# EAGLE design Master (EAGLE 9.6.2)
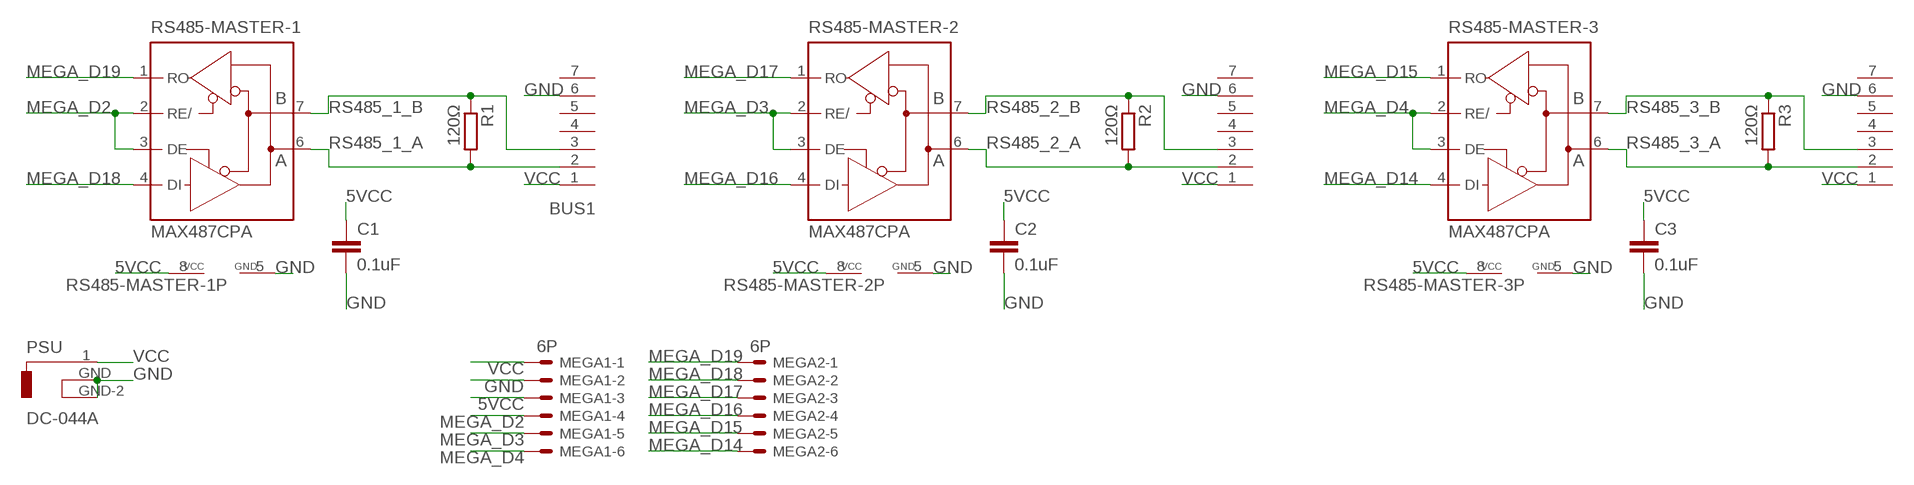
[diagram p0: schematic, sheet 1]

## Parts
BUS1  GX12-7P  [GX12-7P]
BUS2  GX12-7P  [GX12-7P]
BUS3  GX12-7P  [GX12-7P]
C1  0.1uF  C-EU025-025X050  [C025-025X050]
C2  0.1uF  C-EU025-025X050  [C025-025X050]
C3  0.1uF  C-EU025-025X050  [C025-025X050]
MEGA1  6P  22-23-2061  [22-23-2061]
MEGA2  6P  22-23-2061  [22-23-2061]
PSU  DC-044A  [DC-044A]
R1  120Ω  R-EU_0207/10  [0207/10]
R2  120Ω  R-EU_0207/10  [0207/10]
R3  120Ω  R-EU_0207/10  [0207/10]
RS485-MASTER-1  MAX487CPA  [DIL08]
RS485-MASTER-2  MAX487CPA  [DIL08]
RS485-MASTER-3  MAX487CPA  [DIL08]

## Nets
5VCC: C1.1 C2.1 C3.1 MEGA1.3 RS485-MASTER-1.8(VCC) RS485-MASTER-2.8(VCC) RS485-MASTER-3.8(VCC)
GND: BUS1.6 BUS2.6 BUS3.6 C1.2 C2.2 C3.2 MEGA1.2 PSU.GND PSU.GND-2 RS485-MASTER-1.5(GND) RS485-MASTER-2.5(GND) RS485-MASTER-3.5(GND)
MEGA_D2: MEGA1.4 RS485-MASTER-1.2(RE/) RS485-MASTER-1.3(DE)
MEGA_D3: MEGA1.5 RS485-MASTER-2.2(RE/) RS485-MASTER-2.3(DE)
MEGA_D4: MEGA1.6 RS485-MASTER-3.2(RE/) RS485-MASTER-3.3(DE)
MEGA_D14: MEGA2.6 RS485-MASTER-3.4(DI)
MEGA_D15: MEGA2.5 RS485-MASTER-3.1(RO)
MEGA_D16: MEGA2.4 RS485-MASTER-2.4(DI)
MEGA_D17: MEGA2.3 RS485-MASTER-2.1(RO)
MEGA_D18: MEGA2.2 RS485-MASTER-1.4(DI)
MEGA_D19: MEGA2.1 RS485-MASTER-1.1(RO)
RS485_1_A: BUS1.2 R1.2 RS485-MASTER-1.6(A)
RS485_1_B: BUS1.3 R1.1 RS485-MASTER-1.7(B)
RS485_2_A: BUS2.2 R2.2 RS485-MASTER-2.6(A)
RS485_2_B: BUS2.3 R2.1 RS485-MASTER-2.7(B)
RS485_3_A: BUS3.2 R3.2 RS485-MASTER-3.6(A)
RS485_3_B: BUS3.3 R3.1 RS485-MASTER-3.7(B)
VCC: BUS1.1 BUS2.1 BUS3.1 MEGA1.1 PSU.1
Unconnected: BUS1.4 BUS1.5 BUS1.7 BUS2.4 BUS2.5 BUS2.7 BUS3.4 BUS3.5 BUS3.7

## Library data of the parts
BUS1-BUS3 = A10 Library:GX12-7P: GX12 Aviation Connector, 7 pin.
C1-C3 = rcl:C-EU: CAPACITOR, European symbol; SPICEPREFIX: C
MEGA1 MEGA2 = con-molex:22-23-2061: .100" (2.54mm) Center Header - 6 Pin; MF: MOLEX; MPN: 22-23-2061; OC_FARNELL: 1462922; OC_NEWARK: 27C1933
PSU = A10 Library:DC-044A
R1-R3 = rcl:R-EU_: RESISTOR, European symbol; SPICEPREFIX: R
RS485-MASTER-1-RS485-MASTER-3 = A10 Library:MAX487CPA: RS485 TRANSEIVER; MPN: MAX487CPA; OC_FARNELL: unknown; OC_NEWARK: unknown

## Net classes
0 default: width 0.406 mm, drill 0.254 mm, clearance 0.406 mm

## Board
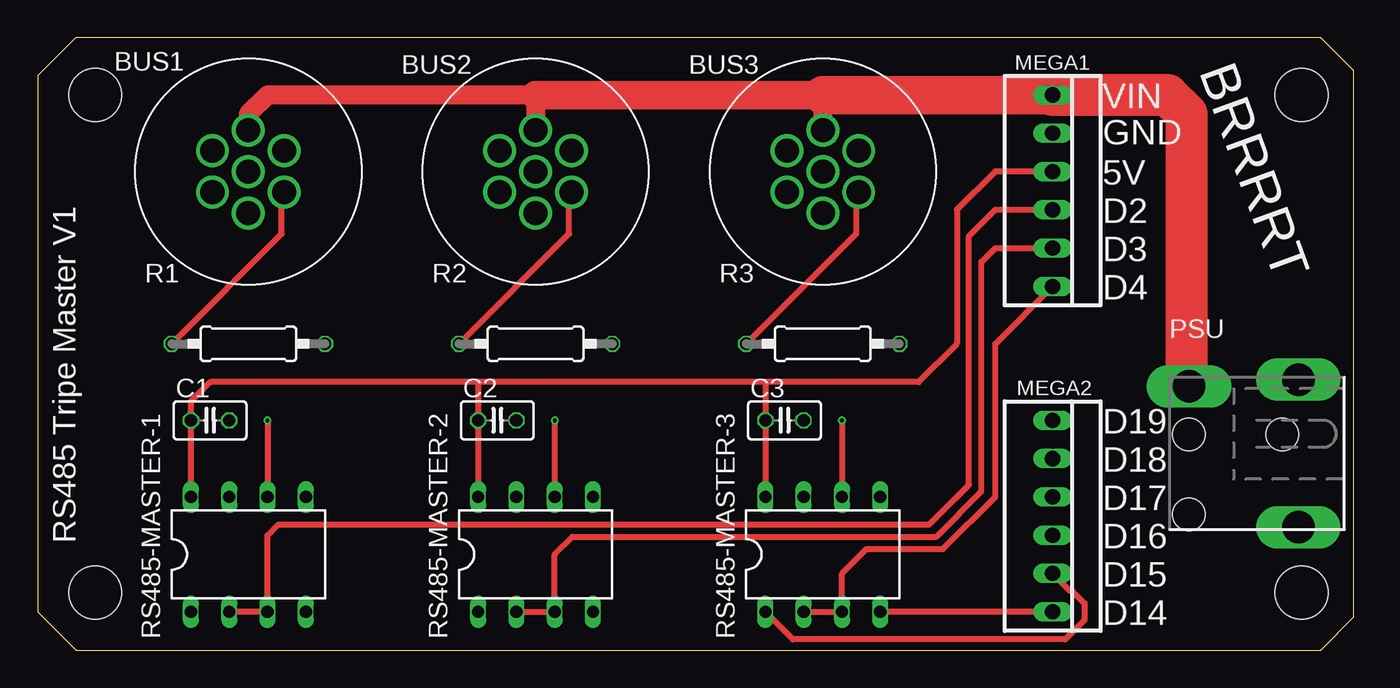
[diagram p1: board, top side]
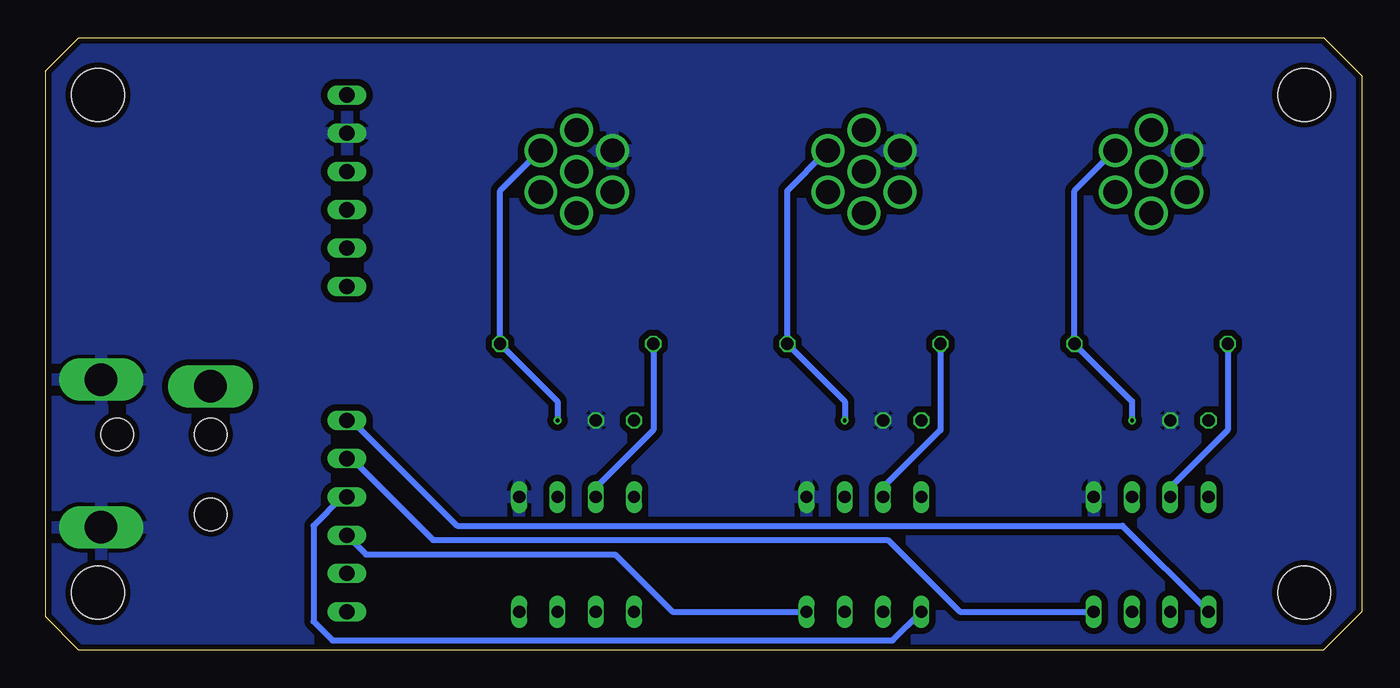
[diagram p2: board, bottom side, seen from below]

Size 87.3 x 40.63 mm. Coordinates in mm from the lower left corner, seen from the top.
Outline: 0,38.1 0,2.54 2.54,0 85.09,0 87.3,2.21 87.3,38.43 85.1,40.63 2.53,40.63 0,38.1
Copper layers (1*16): Top 0.035559375mm / dielectric 1.6mm / Bottom 0.035559375mm
Design rules "oshpark-2layer *": minimum track width 6mil, minimum drill 10mil, track to track 6mil, track to pad 6mil, pad to pad 6mil, via to via 6mil, smd to smd 6mil, copper to edge 15mil, drill to drill 6mil, minimum pad ring 5mil, minimum via ring 5mil, stop-mask expansion 2.5mil, vias tented up to drill 0mil, thermal gap 10mil
Holes 3.5 mm at 3.81,36.83 3.81,3.81 83.82,36.83 83.82,3.81

### Footprints (pad centres in the part's own frame; a part is rotated, then mirrored left to right if it is on the bottom)
GX12-7P = drill 1.6 pad 2.184: 1 0,2.75; 2 2.381,1.375; 3 2.381,-1.375; 4 0,-2.75; 5 -2.381,-1.375; 6 -2.381,1.375; 7 0,0
C025-025X050 = drill 0.813 octagon: 1 -1.27,0; 2 1.27,0
22-23-2061 = drill 1 long: 1 -6.35,0; 2 -3.81,0; 3 -1.27,0; 4 1.27,0; 5 3.81,0; 6 6.35,0
DC-044A = drill 2.159 pad 2.794 long: 1 4.42,3.78; GND 4.87,-3.47; GND-2 -4.93,-3.47 | hole 2.159: 1.22,-2.42; -4.08,3.78; 1.22,3.78
0207/10 = drill 0.813 octagon: 1 -5.08,0; 2 5.08,0
DIL08 = drill 0.813 long: 1 -3.81,-3.81; 2 -1.27,-3.81; 3 1.27,-3.81; 4 3.81,-3.81; 5 3.81,3.81; 6 1.27,3.81; 7 -1.27,3.81; 8 -3.81,3.81

### Placement (x,y rotation side)
BUS1  13.97,31.75 0 top
BUS2  33.02,31.75 0 top
BUS3  52.07,31.75 0 top
C1  11.43,15.24 0 top
C2  30.48,15.24 0 top
C3  49.53,15.24 0 top
MEGA1  67.31,30.48 270 top
MEGA2  67.31,8.89 270 top
PSU  80.14,13.08 90 top
R1  13.97,20.32 0 top
R2  33.02,20.32 0 top
R3  52.07,20.32 0 top
RS485-MASTER-1  13.97,6.35 0 top
RS485-MASTER-2  33.02,6.35 0 top
RS485-MASTER-3  52.07,6.35 0 top

### Tracks (layer width: path | path; a pad name or v marks a point on that pad's centre or on a via)
5VCC
  Top 0.406: MEGA1.3 63.5,31.75 60.96,29.21 60.96,20.32 58.42,17.78 48.26,17.78 | 48.26,17.78 C3.1 RS485-MASTER-3.8 | 48.26,17.78 29.21,17.78 | 29.21,17.78 C2.1 RS485-MASTER-2.8 | 29.21,17.78 11.43,17.78 10.16,16.51 C1.1 RS485-MASTER-1.8
GND
  pour Bottom: -1.27,1.27 -1.27,39.37 1.27,41.91 86.36,41.91 88.9,39.37 88.9,1.27 85.09,-2.54 2.54,-2.54
MEGA_D2
  Top 0.406: RS485-MASTER-1.2 RS485-MASTER-1.3 15.24,7.62 15.95,8.33 59.13,8.33 61.77,10.97 61.77,27.48 63.5,29.21 MEGA1.4
MEGA_D3
  Top 0.406: RS485-MASTER-2.2 RS485-MASTER-2.3 34.29,6.35 35.46,7.52 59.59,7.52 62.59,10.52 62.59,25.76 63.5,26.67 MEGA1.5
MEGA_D4
  Top 0.406: RS485-MASTER-3.2 RS485-MASTER-3.3 53.34,5.08 54.97,6.71 60.05,6.71 63.5,10.16 63.5,20.32 MEGA1.6
MEGA_D14
  Top 0.406: MEGA2.6 RS485-MASTER-3.4
MEGA_D15
  Top 0.406: MEGA2.5 68.49,3.9 68.62,3.9 69.42,3.1 69.42,1.98 68.15,0.71 50.09,0.71 RS485-MASTER-3.1
MEGA_D16
  Bottom 0.406: RS485-MASTER-2.4 45.72,2.54 49.53,6.35 66.04,6.35 MEGA2.4
MEGA_D17
  Bottom 0.406: RS485-MASTER-2.1 31.11,0.64 68.26,0.64 69.53,1.91 69.53,8.26 67.63,10.16 MEGA2.3
MEGA_D18
  Bottom 0.406: RS485-MASTER-1.4 26.67,2.54 31.43,7.3 61.59,7.3 66.99,12.7 MEGA2.2
MEGA_D19
  Bottom 0.406: RS485-MASTER-1.1 15.88,8.26 60.01,8.26 66.99,15.24 MEGA2.1
RS485_1_A  (via drill 0.25)
  Top 0.406: v15.24,15.24 RS485-MASTER-1.6
  Bottom 0.406: v15.24,15.24 15.24,16.51 R1.2 19.05,30.48 16.51,33.02 BUS1.2
RS485_1_B
  Top 0.406: R1.1 16.19,27.62 16.19,30.16 BUS1.3
  Bottom 0.406: RS485-MASTER-1.7 12.7,10.79 8.89,14.61 R1.1
RS485_2_A  (via drill 0.25)
  Top 0.406: v34.29,15.24 RS485-MASTER-2.6
  Bottom 0.406: v34.29,15.24 34.29,16.51 R2.2 38.1,30.48 35.56,33.02 BUS2.2
RS485_2_B
  Top 0.406: R2.1 35.24,27.62 35.24,30.16 BUS2.3
  Bottom 0.406: RS485-MASTER-2.7 31.75,10.79 27.94,14.61 R2.1
RS485_3_A  (via drill 0.25)
  Top 0.406: v53.34,15.24 RS485-MASTER-3.6
  Bottom 0.406: v53.34,15.24 53.34,16.51 R3.2 57.15,30.48 54.61,33.02 BUS3.2
RS485_3_B
  Top 0.406: R3.1 54.29,27.62 54.29,30.16 BUS3.3
  Bottom 0.406: RS485-MASTER-3.7 50.8,10.79 46.99,14.61 R3.1
VCC
  Top 1.27: BUS2.1 33.02,36.83 15.24,36.83 13.97,35.56 BUS1.1 | BUS3.1 52.07,36.83
  Top 1.905: 52.07,36.83 33.02,36.83
  Top 2.54: MEGA1.1 52.07,36.83
  Top 2.794: PSU.1 76.2,17.66 76.2,35.56 74.93,36.83 MEGA1.1

### Text on the board
tNames: VIN | GND | 5V | D2 | D3 | BRRRRT | D4 | D19 | D18 | D17 | RS485 Tripe Master V1 | D16 | D15 | D14